# EAGLE design schematic (EAGLE 9.6.2)
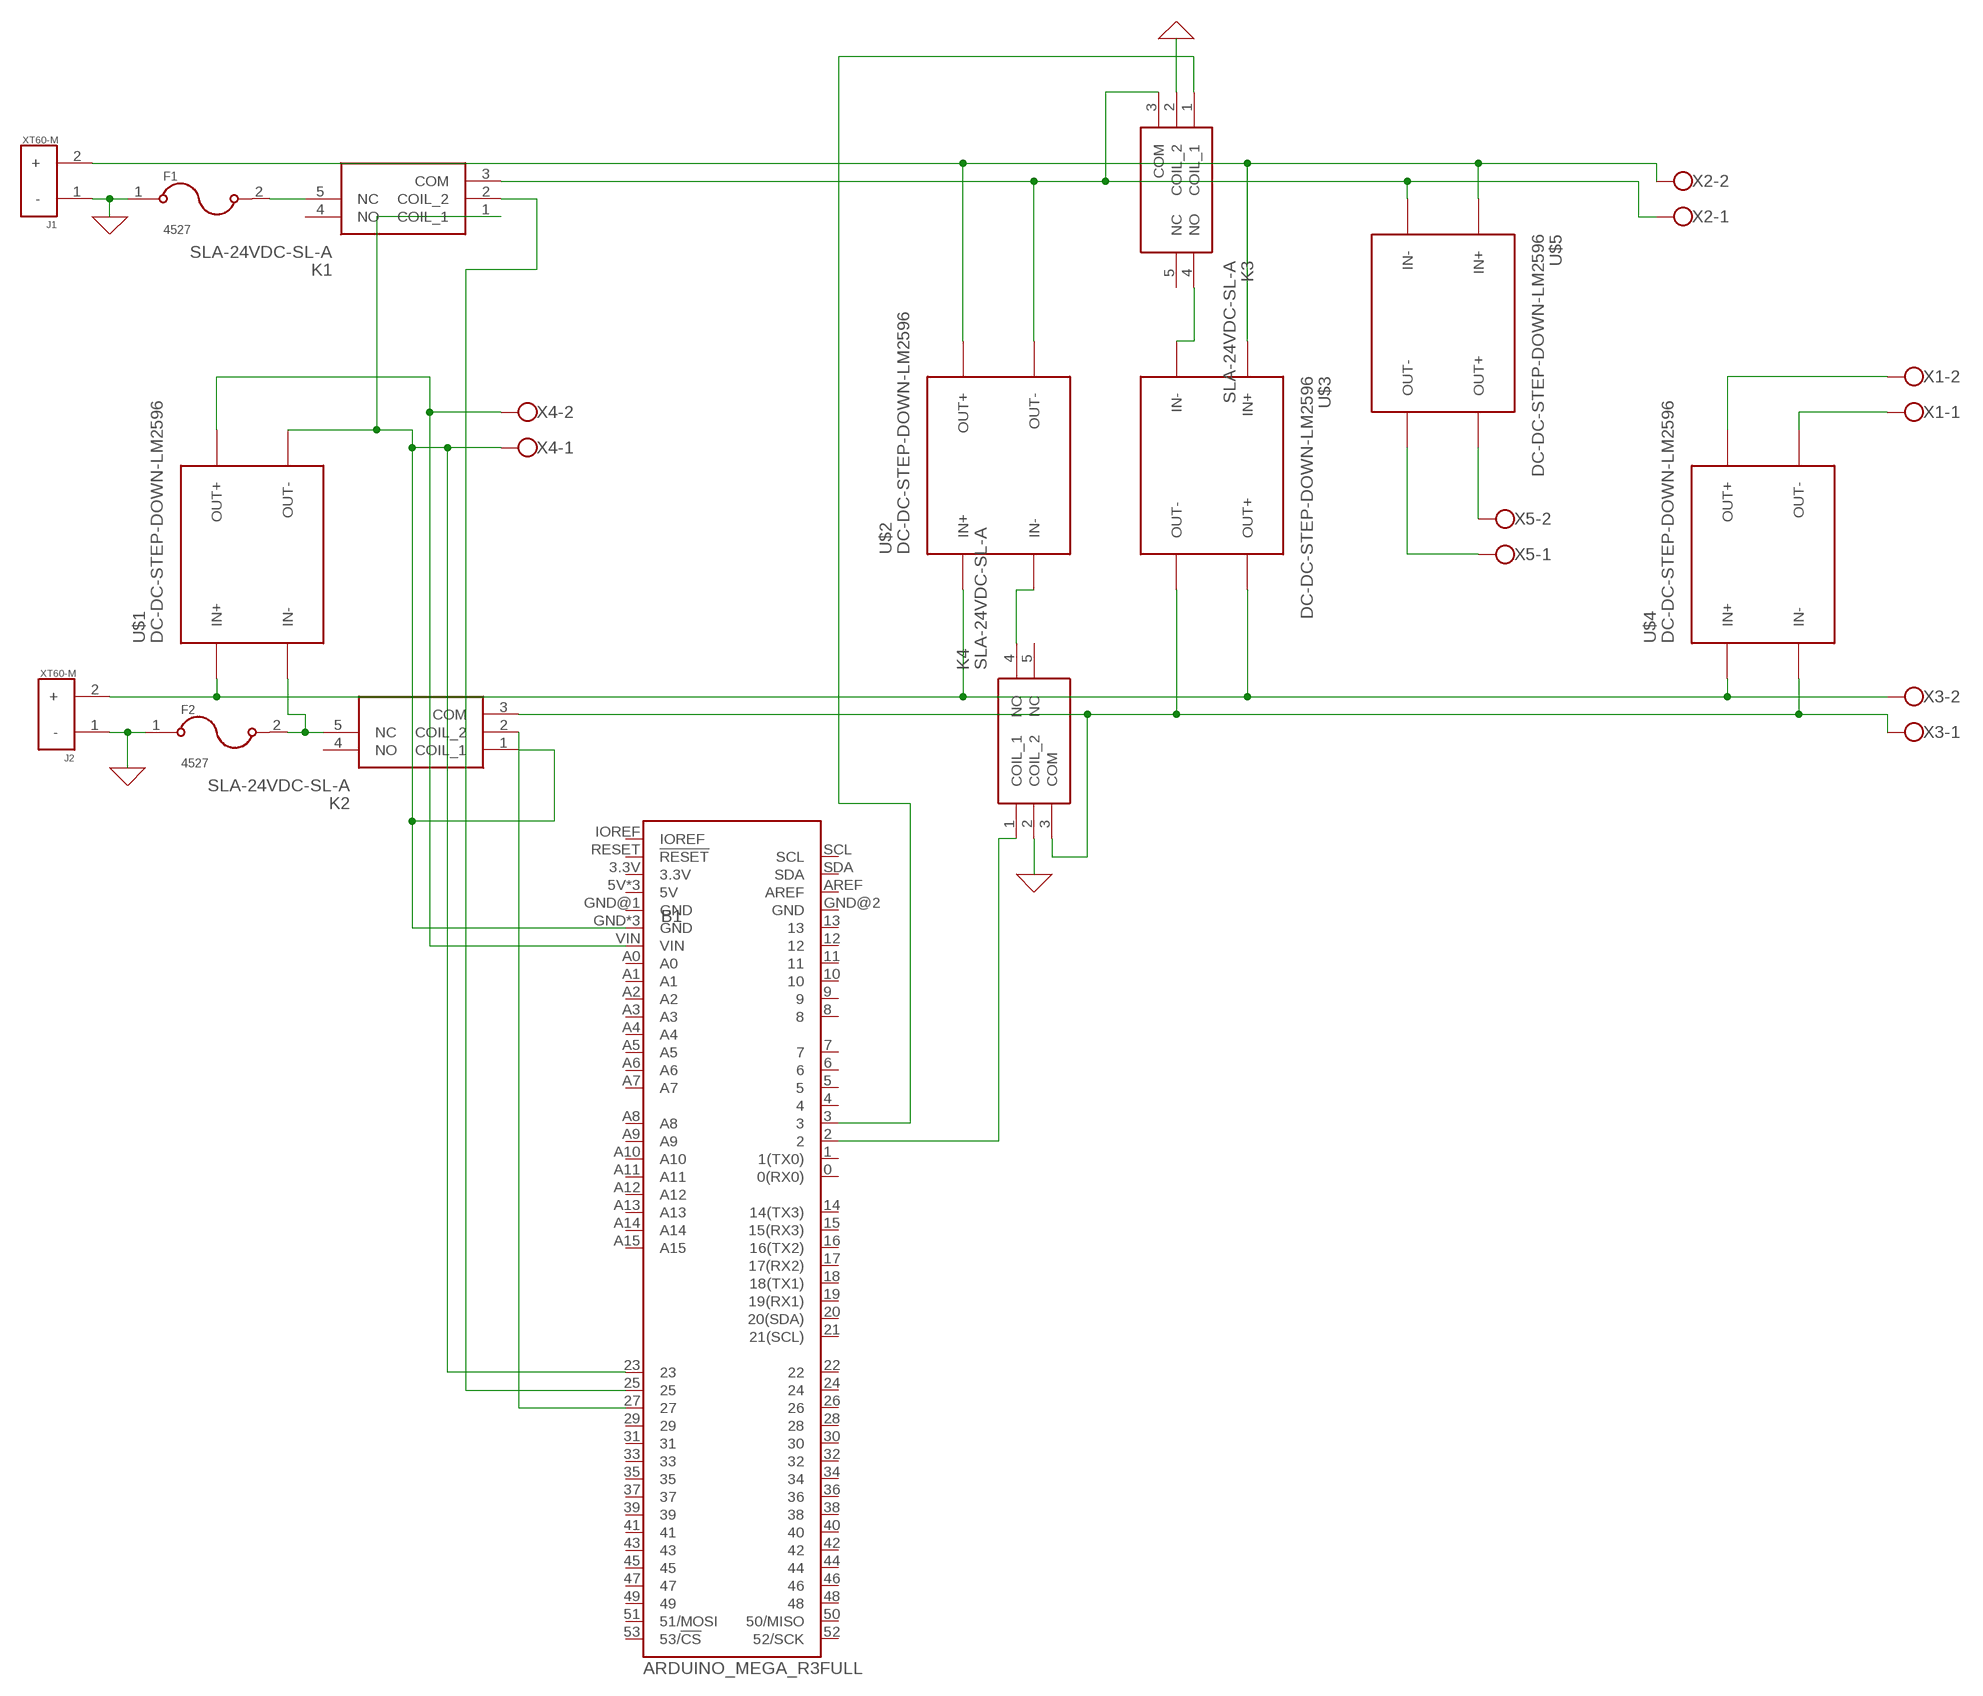
[diagram p0: schematic, sheet 1]

## Parts
B1  ARDUINO_MEGA_R3FULL  [ARDUINO_MEGA_NO_SILK]
F1  4527  [FUSE_4527]
F2  4527  [FUSE_4527]
J1  XT60-M  [AMASS_XT60-M]
J2  XT60-M  [AMASS_XT60-M]
K1  SLA-24VDC-SL-A  [SLA24VDCSLA]
K2  SLA-24VDC-SL-A  [SLA24VDCSLA]
K3  SLA-24VDC-SL-A  [SLA24VDCSLA]
K4  SLA-24VDC-SL-A  [SLA24VDCSLA]
U$1  DC-DC-STEP-DOWN-LM2596  [DC-DC-STEP-DOWN-LM2596]
U$2  DC-DC-STEP-DOWN-LM2596  [DC-DC-STEP-DOWN-LM2596]
U$3  DC-DC-STEP-DOWN-LM2596  [DC-DC-STEP-DOWN-LM2596]
U$4  DC-DC-STEP-DOWN-LM2596  [DC-DC-STEP-DOWN-LM2596]
U$5  DC-DC-STEP-DOWN-LM2596  [DC-DC-STEP-DOWN-LM2596]
X1  W237-102  [W237-102]
X2  W237-102  [W237-102]
X3  W237-102  [W237-102]
X4  W237-102  [W237-102]
X5  W237-102  [W237-102]

## Nets
0: F1.1 F2.1 J1.1(-) J2.1(-) K3.2(COIL_2) K4.2(COIL_2) ; supply symbol labelled GND
N$1: J1.2(+) U$2.OUT+ U$3.IN+ U$5.IN+ X2.2
N$2: F1.2 K1.5(NC)
N$3: K1.3(COM) K3.3(COM) U$2.OUT- U$5.IN- X2.1
N$4: F2.2 K2.5(NC) U$1.IN-
N$5: J2.2(+) U$1.IN+ U$2.IN+ U$3.OUT+ U$4.IN+ X3.2
N$6: K2.3(COM) K4.3(COM) U$3.OUT- U$4.IN- X3.1
N$7: B1.27 K2.2(COIL_2)
N$8: B1.VIN U$1.OUT+ X4.2
N$9: B1.23 B1.GND B1.GND@3(GND) B1.GND@4(GND) K1.1(COIL_1) K2.1(COIL_1) U$1.OUT- X4.1
N$10: U$5.OUT+ X5.2
N$11: B1.25 K1.2(COIL_2)
N$12: U$5.OUT- X5.1
N$13: U$4.OUT+ X1.2
N$14: U$4.OUT- X1.1
N$15: K3.4(NO) U$3.IN-
N$16: K4.4(NO) U$2.IN-
N$17: B1.2 K4.1(COIL_1)
N$18: B1.3 K3.1(COIL_1)
Unconnected: B1.0(0(RX0)) B1.1(1(TX0)) B1.3.3V B1.4 B1.5 B1.5V B1.5V@1(5V) B1.5V@2(5V) B1.6 B1.7 B1.8 B1.9 B1.10 B1.11 B1.12 B1.13 B1.14(14(TX3)) B1.15(15(RX3)) B1.16(16(TX2)) B1.17(17(RX2)) B1.18(18(TX1)) B1.19(19(RX1)) B1.20(20(SDA)) B1.21(21(SCL)) B1.22 B1.24 B1.26 B1.28 B1.29 B1.30 B1.31 B1.32 B1.33 B1.34 B1.35 B1.36 B1.37 B1.38 B1.39 B1.40 B1.41 B1.42 B1.43 B1.44 B1.45 B1.46 B1.47 B1.48 B1.49 B1.50(50/MISO) B1.51(51/MOSI) B1.52(52/SCK) B1.53(53/!CS) B1.A0 B1.A1 B1.A2 B1.A3 B1.A4 B1.A5 B1.A6 B1.A7 B1.A8 B1.A9 B1.A10 B1.A11 B1.A12 B1.A13 B1.A14 B1.A15 B1.AREF B1.GND@1(GND) B1.GND@2(GND) B1.IOREF B1.RESET(!RESET) B1.SCL B1.SDA K1.4(NO) K2.4(NO) K3.5(NC) K4.5(NC)

## Library data of the parts
B1 = SparkFun-Boards:ARDUINO_MEGA_R3: Arduino Mega R3 ATmega2560 R3 compatible footprint. SparkFun Products: Arduino Mega 2560 R3 <https://www.sparkfun.com/products/11061>
F1 F2 = 4527:4527: Fuseholder; 5 A; 250 V; Nylon; Base only; Brass, Tin Plate (Contact) Check prices <https://pricing.snapeda.com/parts/4527/Keystone/view-part?ref=eda>; AVAILABILITY: In Stock; DESCRIPTION: 5mm Low Profile Holder; MF: Keystone; MP: 4527; PACKAGE: None; PRICE: None
J1 J2 = XT60-M:XT60-M: DC supply; XT60; male; PIN:2; for cable; soldered; 60A; 500V Check prices <https://pricing.snapeda.com/parts/XT60-M/AMASS/view-part?ref=eda>; AVAILABILITY: No availability data; DESCRIPTION: Plug; DC supply; XT60; male; PIN: 2; for cable; soldered; 30A; 500V; MF: AMASS; MP: XT60-M; PACKAGE: Package; PRICE: None
K1-K4 = SLA-24VDC-SL-A:SLA-24VDC-SL-A: Relays General Purpose Non Latching 24VDC SPST-NO 30A (240VAC , 28VDC) Nom Plugin4PIN RoHS Source: Datasheet <https://datasheet.lcsc.com/szlcsc/1811200040_Ningbo-Songle-Relay-SLA-24VDC-SL-A_C80812.pdf>; DESCRIPTION: Relays General Purpose Non Latching 24VDC SPST-NO 30A (240VAC , 28VDC) Nom Plugin4PIN RoHS; HEIGHT: 20.4mm; MANUFACTURER_NAME: Songle Relay; MANUFACTURER_PART_NUMBER: SLA-24VDC-SL-A
U$1-U$5 = diy-modules:DC-DC-STEP-DOWN-LM2596: DC/DC Step-Down Regulator based on LM2596-ADJ chip LM2596 datasheet available here: http://www.ti.com/lit/ds/symlink/lm2596.pdf Click here to find device on ebay.com <http://www.ebay.com/sch/lm2596+power+regulator>
X1-X5 = con-wago-500:W237-102: WAGO SCREW CLAMP; MPN: 237-102; OC_FARNELL: unknown; OC_NEWARK: 70K9898

## Board
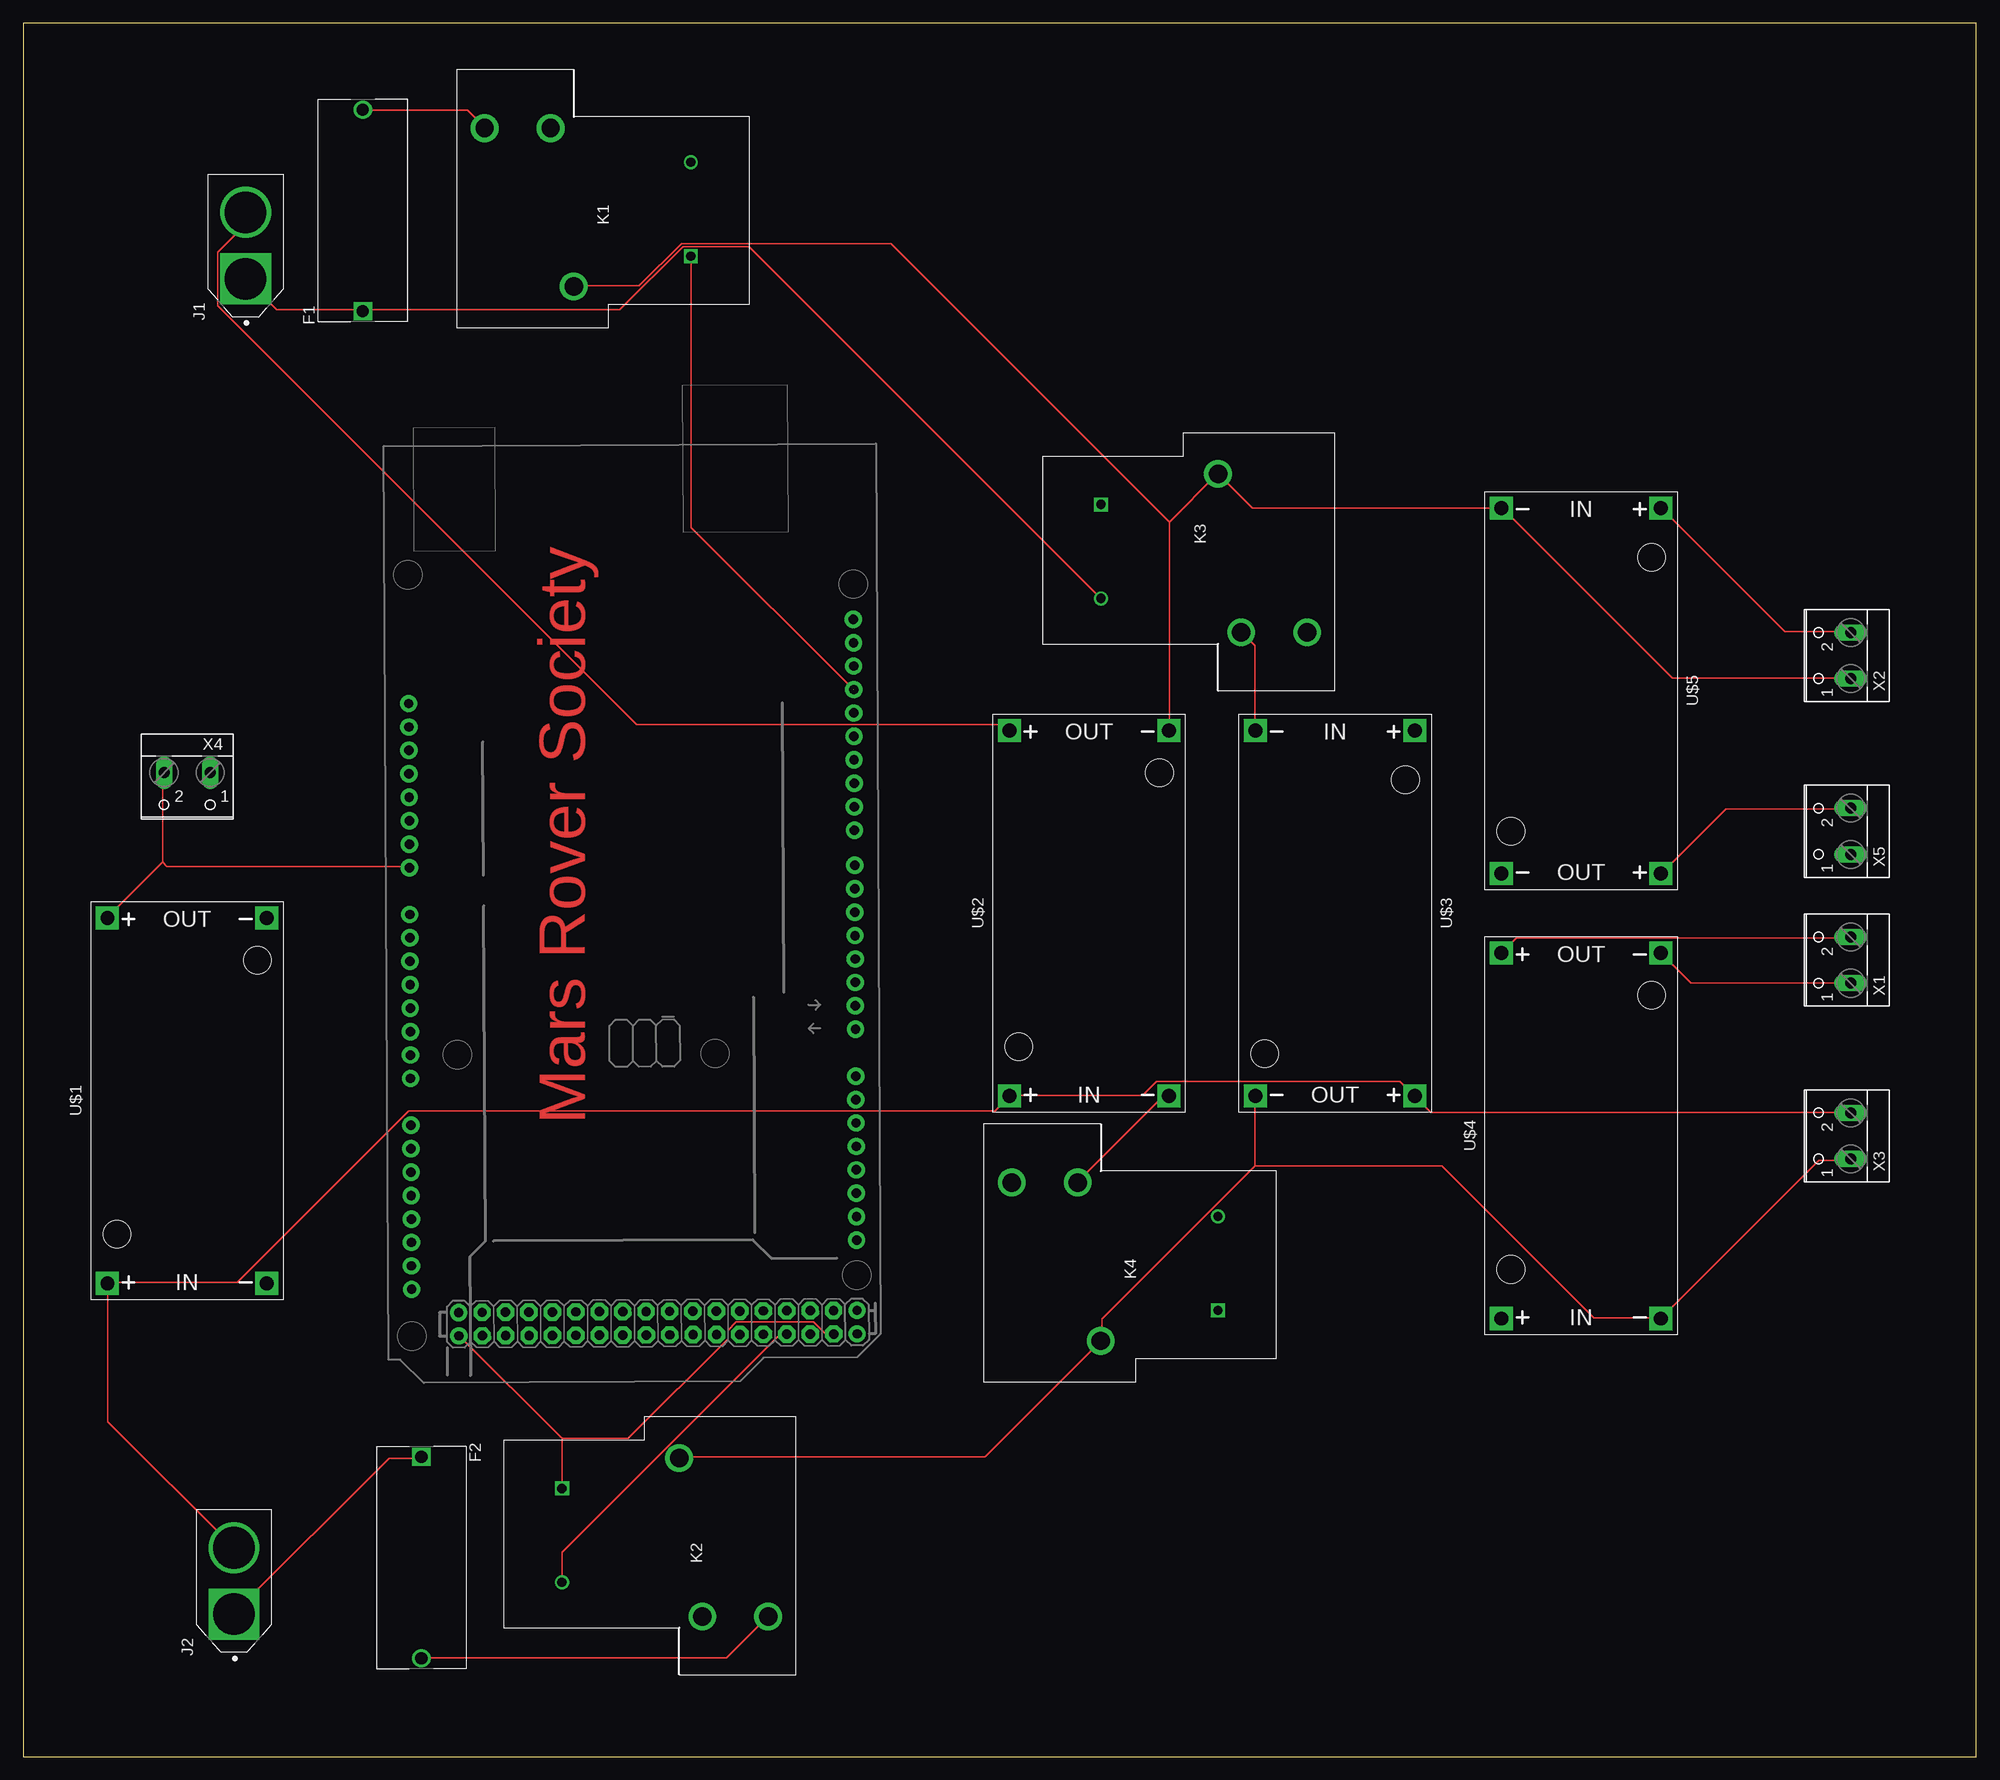
[diagram p1: board, top side]
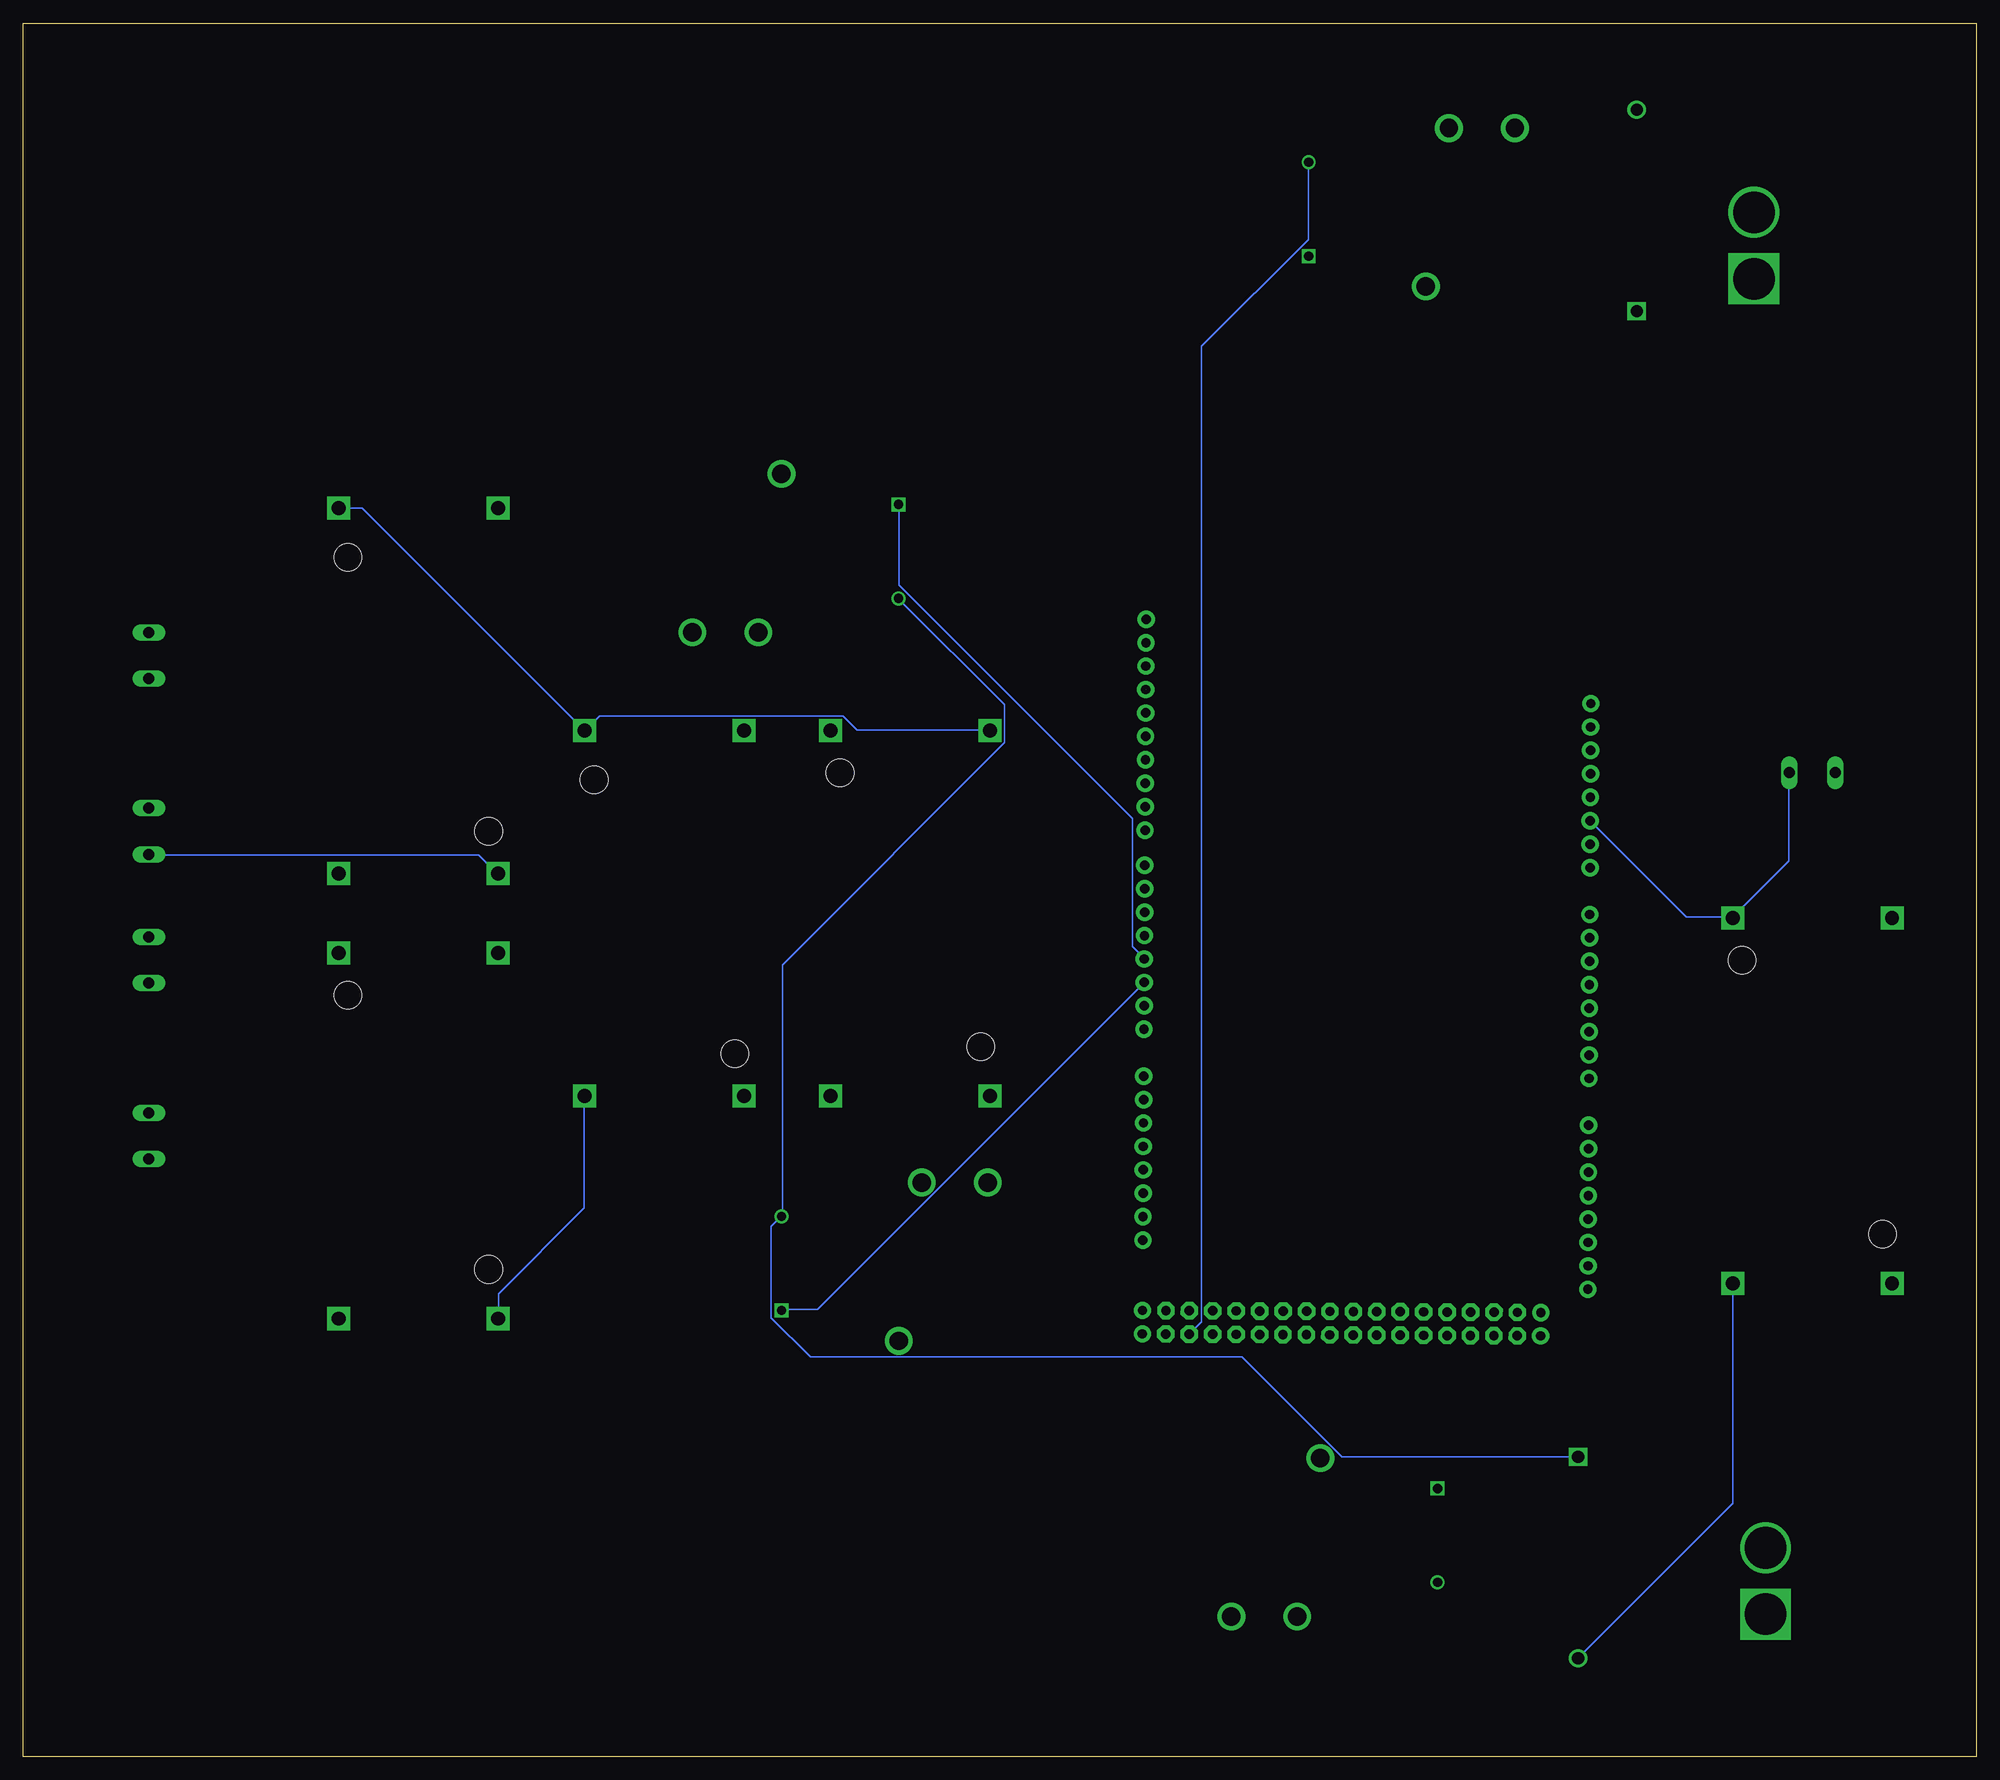
[diagram p2: board, bottom side, seen from below]

Size 211.76 x 187.95 mm. Coordinates in mm from the lower left corner, seen from the top.
Outline: 0,0 211.76,0 211.76,187.95 0,187.95 0,0
Copper layers (1*16): Top 0.035mm / dielectric 1.5mm / Bottom 0.035mm
Design rules "default *": minimum track width 10mil, minimum drill 0.35mm, track to track 6mil, track to pad 6mil, pad to pad 6mil, via to via 6mil, smd to smd 6mil, copper to edge 40mil, drill to drill 6mil, minimum pad ring 10mil, minimum via ring 8mil, stop-mask expansion 4mil, vias tented up to drill 0mil, thermal gap 10mil

### Footprints (pad centres in the part's own frame; a part is rotated, then mirrored left to right if it is on the bottom)
ARDUINO_MEGA_NO_SILK = drill 1.016 pad 1.88: 0 13.97,24.13; 1 11.43,24.13; 2 8.89,24.13; 3 6.35,24.13; 3.3V -13.97,-24.13; 4 3.81,24.13; 5 1.27,24.13; 5V -11.43,-24.13; 5V@1 44.45,24.13; 5V@2 46.99,24.13; 6 -1.27,24.13; 7 -3.81,24.13; 8 -7.62,24.13; 9 -10.16,24.13; 10 -12.7,24.13; 11 -15.24,24.13; 12 -17.78,24.13; 13 -20.32,24.13; 14 19.05,24.13; 15 21.59,24.13; 16 24.13,24.13; 17 26.67,24.13; 18 29.21,24.13; 19 31.75,24.13; 20 34.29,24.13; 21 36.83,24.13; A0 1.27,-24.13; A1 3.81,-24.13; A2 6.35,-24.13; A3 8.89,-24.13; A4 11.43,-24.13; A5 13.97,-24.13; A6 16.51,-24.13; A7 19.05,-24.13; A8 24.13,-24.13; A9 26.67,-24.13; A10 29.21,-24.13; A11 31.75,-24.13; A12 34.29,-24.13; A13 36.83,-24.13; A14 39.37,-24.13; A15 41.91,-24.13; AREF -25.4,24.13; GND -8.89,-24.13; GND@1 -6.35,-24.13; GND@2 44.45,-19.05; GND@3 46.99,-19.05; GND@4 -22.86,24.13; IOREF -19.05,-24.13; NC -21.59,-24.13; RESET -16.51,-24.13; SCL -30.48,24.13; SDA -27.94,24.13; VIN -3.81,-24.13 | drill 1.016 pad 1.88 octagon: 22 44.45,21.59; 23 46.99,21.59; 24 44.45,19.05; 25 46.99,19.05; 26 44.45,16.51; 27 46.99,16.51; 28 44.45,13.97; 29 46.99,13.97; 30 44.45,11.43; 31 46.99,11.43; 32 44.45,8.89; 33 46.99,8.89; 34 44.45,6.35; 35 46.99,6.35; 36 44.45,3.81; 37 46.99,3.81; 38 44.45,1.27; 39 46.99,1.27; 40 44.45,-1.27; 41 46.99,-1.27; 42 44.45,-3.81; 43 46.99,-3.81; 44 44.45,-6.35; 45 46.99,-6.35; 46 44.45,-8.89; 47 46.99,-8.89; 48 44.45,-11.43; 49 46.99,-11.43; 50 44.45,-13.97; 51 46.99,-13.97; 52 44.45,-16.51; 53 46.99,-16.51
FUSE_4527 = drill 1.32 square: 1 -10.92,0 | drill 1.32: 2 10.92,0
AMASS_XT60-M = drill 4.5 square: 1 -3.6,0 | drill 4.5: 2 3.6,0
SLA24VDCSLA = drill 1 pad 1.5 square: 1 0.127,1.27 | drill 1 pad 1.5: 2 10.312,1.27 | drill 2 pad 3: 3 -3.175,13.97; 4 14,16.47; 5 14,23.622
DC-DC-STEP-DOWN-LM2596 = drill 1.5 pad 2.5 square: IN+ -19.812,8.636; IN- -19.812,-8.636; OUT+ 19.812,8.636; OUT- 19.812,-8.636 | hole 3: -14.478,7.62; 15.24,-7.62
W237-102 = drill 1.194 long: 1 -2.5,-1.27; 2 2.5,-1.27

### Placement (x,y rotation side)
B1  66.04,92.71 270.3 top
F1  36.83,167.64 90 top
F2  43.18,21.59 270 top
J1  24.13,163.83 90 top
J2  22.86,19.05 90 top
K1  73.66,162.56 90 top
K2  57.15,29.21 270 top
K3  115.57,135.89 270 top
K4  130.81,48.26 90 top
U$1  17.78,71.12 90 top
U$2  115.57,91.44 90 top
U$3  142.24,91.44 270 top
U$4  168.91,67.31 90 top
U$5  168.91,115.57 270 top
X1  196.85,86.36 90 top
X2  196.85,119.38 90 top
X3  196.85,67.31 90 top
X4  17.78,105.41 180 top
X5  196.85,100.33 90 top

### Tracks (layer width: path | path; a pad name or v marks a point on that pad's centre or on a via)
0
  Top 0.152: F2.1 43.18,32.36 39.68,32.36 22.91,15.6 J2.1 | J1.1 27.48,156.87 36.78,156.87 F1.1 36.93,156.87 64.67,156.87 71.53,163.73 78.69,163.73 K3.2
  Bottom 0.152: K3.2 116.79,125.48 105.36,114.05 105.36,109.93 129.44,85.85 129.44,58.57 K4.2 129.59,58.57 130.66,57.51 130.66,47.6 126.39,43.33 79.6,43.33 68.78,32.51 F2.1
N$1
  Top 0.152: X2.2 198.02,121.97 191.01,121.97 177.6,135.38 U$5.IN+ | J1.2 24.13,166.17 21.08,163.12 21.08,157.33 66.5,111.91 106.27,111.91 U$2.OUT+
  Bottom 0.152: U$2.OUT+ 107.04,111.3 121.36,111.3 122.89,112.83 149.25,112.83 150.77,111.3 U$3.IN+ 175.01,135.38 U$5.IN+
N$2
  Top 0.152: F1.2 36.93,178.51 48.21,178.51 50.04,176.68 K1.5
N$3
  Top 0.152: X2.1 198.02,116.94 178.82,116.94 160.38,135.38 U$5.IN- 133.25,135.38 129.59,139.04 K3.3 129.44,139.04 124.26,133.86 | 124.26,133.86 124.26,111.3 U$2.OUT- | 124.26,133.86 94.08,164.03 71.37,164.03 66.8,159.46 59.79,159.46 K1.3
N$4
  Top 0.152: F2.2 43.18,10.72 76.25,10.72 80.67,15.14 K2.5
  Bottom 0.152: U$1.IN- 26.42,27.48 43.18,10.72 F2.2
N$5
  Top 0.152: J2.2 22.76,22.76 9.2,36.32 9.2,51.26 U$1.IN+ 9.2,51.41 23.22,51.41 41.81,70 105.36,70 106.88,71.53 U$2.IN+ 107.04,71.68 121.36,71.68 122.89,73.2 149.25,73.2 150.77,71.68 U$3.OUT+ 150.93,71.53 152.6,69.85 198.02,69.85 X3.2
  Bottom 0.152: U$4.IN+ 160.22,47.6 160.22,50.19 150.93,59.49 150.93,71.53 U$3.OUT+
N$6
  Top 0.152: X3.1 198.02,64.67 194.67,64.67 177.6,47.6 U$4.IN- 177.44,47.6 170.28,47.6 153.82,64.06 133.55,64.06 | 133.55,64.06 133.55,71.53 U$3.OUT- | 133.55,64.06 116.94,47.45 116.94,45.16 K4.3 116.79,45.01 104.29,32.51 71.22,32.51 K2.3
N$7
  Top 0.152: K2.2 58.42,22.15 82.04,45.77 82.65,45.77 B1.27
N$8
  Top 0.152: 15.14,96.98 15.14,106.58 X4.2 | 15.14,96.98 9.2,91.03 U$1.OUT+ | 15.14,96.98 15.6,96.52 41.81,96.52 B1.VIN
N$9  (1 unrouted)
  Top 0.152: 58.42,34.49 K2.1 | 58.42,34.49 47.3,45.62 B1.GND@3 | K1.1 72.44,162.66 72.44,133.25 89.97,115.72 B1.GND@4 | 58.42,34.49 65.58,34.49 76.4,45.31 76.4,46.23 77.32,47.14 85.7,47.14 86.92,45.92 87.83,45.92 B1.23
  Bottom 0.152: 26.42,91.03 20.32,97.13 20.32,106.58 X4.1 | 26.42,91.03 31.45,91.03 41.81,101.4 B1.GND | 26.42,91.03 U$1.OUT-
N$10
  Top 0.152: X5.2 198.02,102.77 184.61,102.77 177.6,95.76 U$5.OUT+
N$11
  Bottom 0.152: K1.2 72.44,172.87 72.44,164.49 84.02,152.91 84.02,47.14 85.24,45.92 B1.25
N$12
  Bottom 0.152: X5.1 198.02,97.74 162.36,97.74 160.38,95.76 U$5.OUT-
N$13
  Top 0.152: U$4.OUT+ 161.9,88.75 198.02,88.75 X1.2
N$14
  Top 0.152: U$4.OUT- 180.8,83.87 198.02,83.87 X1.1
N$15
  Top 0.152: U$3.IN- 133.55,111.3 133.55,120.45 132.18,121.82 K3.4
N$16
  Top 0.152: U$2.IN- 124.1,71.53 123.5,71.53 114.35,62.38 K4.4
N$17
  Bottom 0.152: K4.1 129.44,48.51 125.63,48.51 90.27,83.87 B1.2
N$18
  Bottom 0.152: K3.1 116.79,135.69 116.79,127 91.49,101.7 91.49,87.83 90.27,86.61 B1.3

### Text on the board
Top: Mars Rover Society